# EAGLE schematic eit_passive_filter (EAGLE 9.6.2)

## Sheet 1 of 3
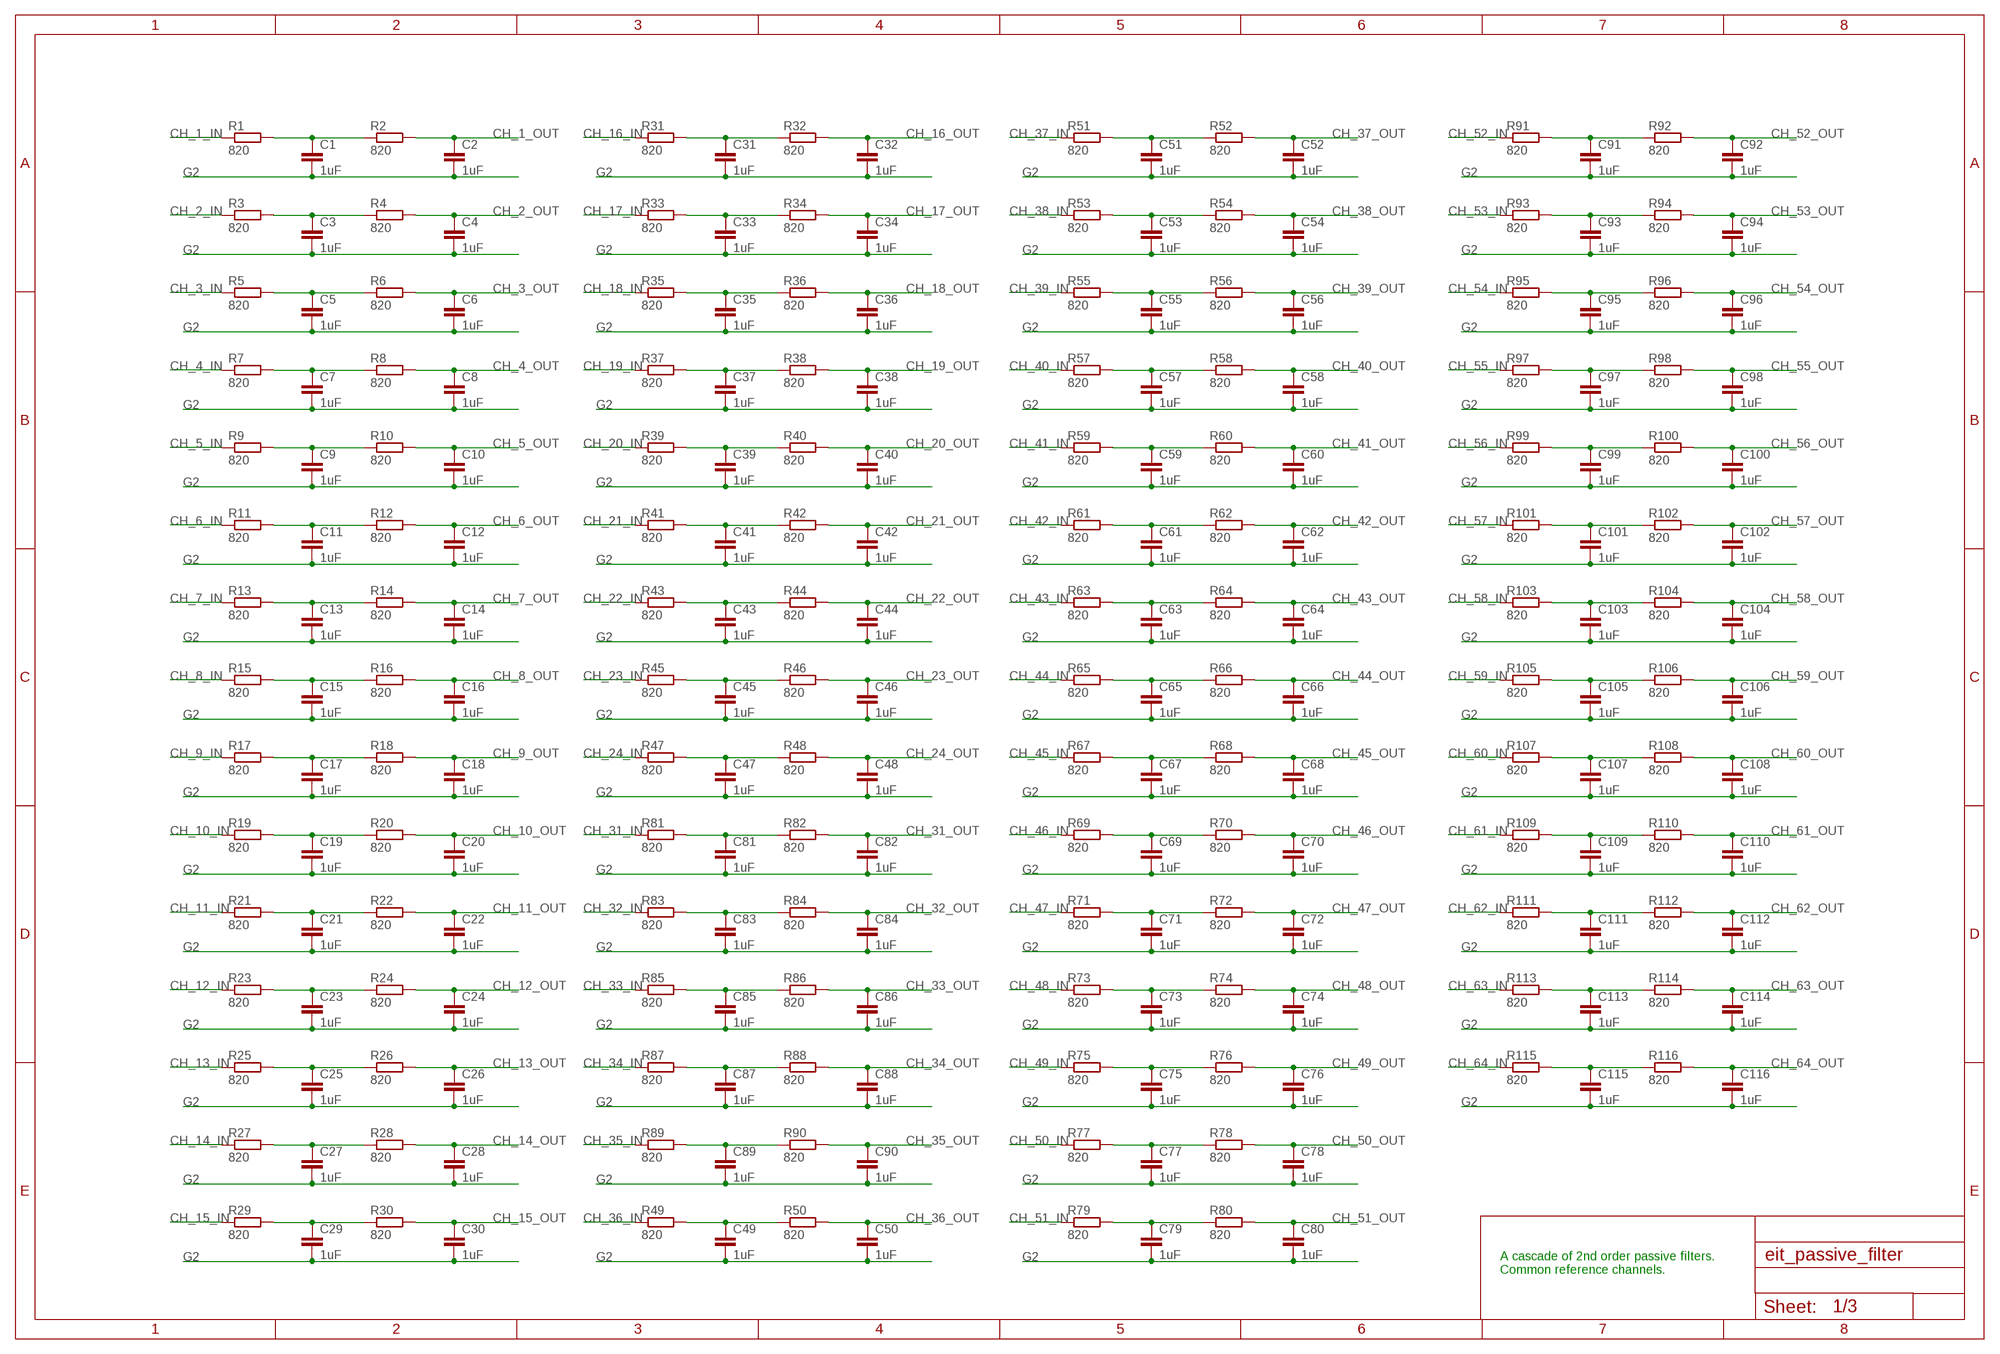
[diagram p0: schematic, sheet 1]

### Parts
C1  1uF  C-EUC0402  [C0402]
C2  1uF  C-EUC0402  [C0402]
C3  1uF  C-EUC0402  [C0402]
C4  1uF  C-EUC0402  [C0402]
C5  1uF  C-EUC0402  [C0402]
C6  1uF  C-EUC0402  [C0402]
C7  1uF  C-EUC0402  [C0402]
C8  1uF  C-EUC0402  [C0402]
C9  1uF  C-EUC0402  [C0402]
C10  1uF  C-EUC0402  [C0402]
C11  1uF  C-EUC0402  [C0402]
C12  1uF  C-EUC0402  [C0402]
C13  1uF  C-EUC0402  [C0402]
C14  1uF  C-EUC0402  [C0402]
C15  1uF  C-EUC0402  [C0402]
C16  1uF  C-EUC0402  [C0402]
C17  1uF  C-EUC0402  [C0402]
C18  1uF  C-EUC0402  [C0402]
C19  1uF  C-EUC0402  [C0402]
C20  1uF  C-EUC0402  [C0402]
C21  1uF  C-EUC0402  [C0402]
C22  1uF  C-EUC0402  [C0402]
C23  1uF  C-EUC0402  [C0402]
C24  1uF  C-EUC0402  [C0402]
C25  1uF  C-EUC0402  [C0402]
C26  1uF  C-EUC0402  [C0402]
C27  1uF  C-EUC0402  [C0402]
C28  1uF  C-EUC0402  [C0402]
C29  1uF  C-EUC0402  [C0402]
C30  1uF  C-EUC0402  [C0402]
C31  1uF  C-EUC0402  [C0402]
C32  1uF  C-EUC0402  [C0402]
C33  1uF  C-EUC0402  [C0402]
C34  1uF  C-EUC0402  [C0402]
C35  1uF  C-EUC0402  [C0402]
C36  1uF  C-EUC0402  [C0402]
C37  1uF  C-EUC0402  [C0402]
C38  1uF  C-EUC0402  [C0402]
C39  1uF  C-EUC0402  [C0402]
C40  1uF  C-EUC0402  [C0402]
C41  1uF  C-EUC0402  [C0402]
C42  1uF  C-EUC0402  [C0402]
C43  1uF  C-EUC0402  [C0402]
C44  1uF  C-EUC0402  [C0402]
C45  1uF  C-EUC0402  [C0402]
C46  1uF  C-EUC0402  [C0402]
C47  1uF  C-EUC0402  [C0402]
C48  1uF  C-EUC0402  [C0402]
C49  1uF  C-EUC0402  [C0402]
C50  1uF  C-EUC0402  [C0402]
C51  1uF  C-EUC0402  [C0402]
C52  1uF  C-EUC0402  [C0402]
C53  1uF  C-EUC0402  [C0402]
C54  1uF  C-EUC0402  [C0402]
C55  1uF  C-EUC0402  [C0402]
C56  1uF  C-EUC0402  [C0402]
C57  1uF  C-EUC0402  [C0402]
C58  1uF  C-EUC0402  [C0402]
C59  1uF  C-EUC0402  [C0402]
C60  1uF  C-EUC0402  [C0402]
C61  1uF  C-EUC0402  [C0402]
C62  1uF  C-EUC0402  [C0402]
C63  1uF  C-EUC0402  [C0402]
C64  1uF  C-EUC0402  [C0402]
C65  1uF  C-EUC0402  [C0402]
C66  1uF  C-EUC0402  [C0402]
C67  1uF  C-EUC0402  [C0402]
C68  1uF  C-EUC0402  [C0402]
C69  1uF  C-EUC0402  [C0402]
C70  1uF  C-EUC0402  [C0402]
C71  1uF  C-EUC0402  [C0402]
C72  1uF  C-EUC0402  [C0402]
C73  1uF  C-EUC0402  [C0402]
C74  1uF  C-EUC0402  [C0402]
C75  1uF  C-EUC0402  [C0402]
C76  1uF  C-EUC0402  [C0402]
C77  1uF  C-EUC0402  [C0402]
C78  1uF  C-EUC0402  [C0402]
C79  1uF  C-EUC0402  [C0402]
C80  1uF  C-EUC0402  [C0402]
C81  1uF  C-EUC0402  [C0402]
C82  1uF  C-EUC0402  [C0402]
C83  1uF  C-EUC0402  [C0402]
C84  1uF  C-EUC0402  [C0402]
C85  1uF  C-EUC0402  [C0402]
C86  1uF  C-EUC0402  [C0402]
C87  1uF  C-EUC0402  [C0402]
C88  1uF  C-EUC0402  [C0402]
C89  1uF  C-EUC0402  [C0402]
C90  1uF  C-EUC0402  [C0402]
C91  1uF  C-EUC0402  [C0402]
C92  1uF  C-EUC0402  [C0402]
C93  1uF  C-EUC0402  [C0402]
C94  1uF  C-EUC0402  [C0402]
C95  1uF  C-EUC0402  [C0402]
C96  1uF  C-EUC0402  [C0402]
C97  1uF  C-EUC0402  [C0402]
C98  1uF  C-EUC0402  [C0402]
C99  1uF  C-EUC0402  [C0402]
C100  1uF  C-EUC0402  [C0402]
C101  1uF  C-EUC0402  [C0402]
C102  1uF  C-EUC0402  [C0402]
C103  1uF  C-EUC0402  [C0402]
C104  1uF  C-EUC0402  [C0402]
C105  1uF  C-EUC0402  [C0402]
C106  1uF  C-EUC0402  [C0402]
C107  1uF  C-EUC0402  [C0402]
C108  1uF  C-EUC0402  [C0402]
C109  1uF  C-EUC0402  [C0402]
C110  1uF  C-EUC0402  [C0402]
C111  1uF  C-EUC0402  [C0402]
C112  1uF  C-EUC0402  [C0402]
C113  1uF  C-EUC0402  [C0402]
C114  1uF  C-EUC0402  [C0402]
C115  1uF  C-EUC0402  [C0402]
C116  1uF  C-EUC0402  [C0402]
R1  820  R-EU_R0402  [R0402]
R2  820  R-EU_R0402  [R0402]
R3  820  R-EU_R0402  [R0402]
R4  820  R-EU_R0402  [R0402]
R5  820  R-EU_R0402  [R0402]
R6  820  R-EU_R0402  [R0402]
R7  820  R-EU_R0402  [R0402]
R8  820  R-EU_R0402  [R0402]
R9  820  R-EU_R0402  [R0402]
R10  820  R-EU_R0402  [R0402]
R11  820  R-EU_R0402  [R0402]
R12  820  R-EU_R0402  [R0402]
R13  820  R-EU_R0402  [R0402]
R14  820  R-EU_R0402  [R0402]
R15  820  R-EU_R0402  [R0402]
R16  820  R-EU_R0402  [R0402]
R17  820  R-EU_R0402  [R0402]
R18  820  R-EU_R0402  [R0402]
R19  820  R-EU_R0402  [R0402]
R20  820  R-EU_R0402  [R0402]
R21  820  R-EU_R0402  [R0402]
R22  820  R-EU_R0402  [R0402]
R23  820  R-EU_R0402  [R0402]
R24  820  R-EU_R0402  [R0402]
R25  820  R-EU_R0402  [R0402]
R26  820  R-EU_R0402  [R0402]
R27  820  R-EU_R0402  [R0402]
R28  820  R-EU_R0402  [R0402]
R29  820  R-EU_R0402  [R0402]
R30  820  R-EU_R0402  [R0402]
R31  820  R-EU_R0402  [R0402]
R32  820  R-EU_R0402  [R0402]
R33  820  R-EU_R0402  [R0402]
R34  820  R-EU_R0402  [R0402]
R35  820  R-EU_R0402  [R0402]
R36  820  R-EU_R0402  [R0402]
R37  820  R-EU_R0402  [R0402]
R38  820  R-EU_R0402  [R0402]
R39  820  R-EU_R0402  [R0402]
R40  820  R-EU_R0402  [R0402]
R41  820  R-EU_R0402  [R0402]
R42  820  R-EU_R0402  [R0402]
R43  820  R-EU_R0402  [R0402]
R44  820  R-EU_R0402  [R0402]
R45  820  R-EU_R0402  [R0402]
R46  820  R-EU_R0402  [R0402]
R47  820  R-EU_R0402  [R0402]
R48  820  R-EU_R0402  [R0402]
R49  820  R-EU_R0402  [R0402]
R50  820  R-EU_R0402  [R0402]
R51  820  R-EU_R0402  [R0402]
R52  820  R-EU_R0402  [R0402]
R53  820  R-EU_R0402  [R0402]
R54  820  R-EU_R0402  [R0402]
R55  820  R-EU_R0402  [R0402]
R56  820  R-EU_R0402  [R0402]
R57  820  R-EU_R0402  [R0402]
R58  820  R-EU_R0402  [R0402]
R59  820  R-EU_R0402  [R0402]
R60  820  R-EU_R0402  [R0402]
R61  820  R-EU_R0402  [R0402]
R62  820  R-EU_R0402  [R0402]
R63  820  R-EU_R0402  [R0402]
R64  820  R-EU_R0402  [R0402]
R65  820  R-EU_R0402  [R0402]
R66  820  R-EU_R0402  [R0402]
R67  820  R-EU_R0402  [R0402]
R68  820  R-EU_R0402  [R0402]
R69  820  R-EU_R0402  [R0402]
R70  820  R-EU_R0402  [R0402]
R71  820  R-EU_R0402  [R0402]
R72  820  R-EU_R0402  [R0402]
R73  820  R-EU_R0402  [R0402]
R74  820  R-EU_R0402  [R0402]
R75  820  R-EU_R0402  [R0402]
R76  820  R-EU_R0402  [R0402]
R77  820  R-EU_R0402  [R0402]
R78  820  R-EU_R0402  [R0402]
R79  820  R-EU_R0402  [R0402]
R80  820  R-EU_R0402  [R0402]
R81  820  R-EU_R0402  [R0402]
R82  820  R-EU_R0402  [R0402]
R83  820  R-EU_R0402  [R0402]
R84  820  R-EU_R0402  [R0402]
R85  820  R-EU_R0402  [R0402]
R86  820  R-EU_R0402  [R0402]
R87  820  R-EU_R0402  [R0402]
R88  820  R-EU_R0402  [R0402]
R89  820  R-EU_R0402  [R0402]
R90  820  R-EU_R0402  [R0402]
R91  820  R-EU_R0402  [R0402]
R92  820  R-EU_R0402  [R0402]
R93  820  R-EU_R0402  [R0402]
R94  820  R-EU_R0402  [R0402]
R95  820  R-EU_R0402  [R0402]
R96  820  R-EU_R0402  [R0402]
R97  820  R-EU_R0402  [R0402]
R98  820  R-EU_R0402  [R0402]
R99  820  R-EU_R0402  [R0402]
R100  820  R-EU_R0402  [R0402]
R101  820  R-EU_R0402  [R0402]
R102  820  R-EU_R0402  [R0402]
R103  820  R-EU_R0402  [R0402]
R104  820  R-EU_R0402  [R0402]
R105  820  R-EU_R0402  [R0402]
R106  820  R-EU_R0402  [R0402]
R107  820  R-EU_R0402  [R0402]
R108  820  R-EU_R0402  [R0402]
R109  820  R-EU_R0402  [R0402]
R110  820  R-EU_R0402  [R0402]
R111  820  R-EU_R0402  [R0402]
R112  820  R-EU_R0402  [R0402]
R113  820  R-EU_R0402  [R0402]
R114  820  R-EU_R0402  [R0402]
R115  820  R-EU_R0402  [R0402]
R116  820  R-EU_R0402  [R0402]

### Nets
CH_1_IN: R1.1 ; also sheet 3
CH_1_OUT: C2.1 R2.2 ; also sheet 3
CH_2_IN: R3.1 ; also sheet 3
CH_2_OUT: C4.1 R4.2 ; also sheet 3
CH_3_IN: R5.1 ; also sheet 3
CH_3_OUT: C6.1 R6.2 ; also sheet 3
CH_4_IN: R7.1 ; also sheet 3
CH_4_OUT: C8.1 R8.2 ; also sheet 3
CH_5_IN: R9.1 ; also sheet 3
CH_5_OUT: C10.1 R10.2 ; also sheet 3
CH_6_IN: R11.1 ; also sheet 3
CH_6_OUT: C12.1 R12.2 ; also sheet 3
CH_7_IN: R13.1 ; also sheet 3
CH_7_OUT: C14.1 R14.2 ; also sheet 3
CH_8_IN: R15.1 ; also sheet 3
CH_8_OUT: C16.1 R16.2 ; also sheet 3
CH_9_IN: R17.1 ; also sheet 3
CH_9_OUT: C18.1 R18.2 ; also sheet 3
CH_10_IN: R19.1 ; also sheet 3
CH_10_OUT: C20.1 R20.2 ; also sheet 3
CH_11_IN: R21.1 ; also sheet 3
CH_11_OUT: C22.1 R22.2 ; also sheet 3
CH_12_IN: R23.1 ; also sheet 3
CH_12_OUT: C24.1 R24.2 ; also sheet 3
CH_13_IN: R25.1 ; also sheet 3
CH_13_OUT: C26.1 R26.2 ; also sheet 3
CH_14_IN: R27.1 ; also sheet 3
CH_14_OUT: C28.1 R28.2 ; also sheet 3
CH_15_IN: R29.1 ; also sheet 3
CH_15_OUT: C30.1 R30.2 ; also sheet 3
CH_16_IN: R31.1 ; also sheet 3
CH_16_OUT: C32.1 R32.2 ; also sheet 3
CH_17_IN: R33.1 ; also sheet 3
CH_17_OUT: C34.1 R34.2 ; also sheet 3
CH_18_IN: R35.1 ; also sheet 3
CH_18_OUT: C36.1 R36.2 ; also sheet 3
CH_19_IN: R37.1 ; also sheet 3
CH_19_OUT: C38.1 R38.2 ; also sheet 3
CH_20_IN: R39.1 ; also sheet 3
CH_20_OUT: C40.1 R40.2 ; also sheet 3
CH_21_IN: R41.1 ; also sheet 3
CH_21_OUT: C42.1 R42.2 ; also sheet 3
CH_22_IN: R43.1 ; also sheet 3
CH_22_OUT: C44.1 R44.2 ; also sheet 3
CH_23_IN: R45.1 ; also sheet 3
CH_23_OUT: C46.1 R46.2 ; also sheet 3
CH_24_IN: R47.1 ; also sheet 3
CH_24_OUT: C48.1 R48.2 ; also sheet 3
CH_31_IN: R81.1 ; also sheet 3
CH_31_OUT: C82.1 R82.2 ; also sheet 3
CH_32_IN: R83.1 ; also sheet 3
CH_32_OUT: C84.1 R84.2 ; also sheet 3
CH_33_IN: R85.1 ; also sheet 3
CH_33_OUT: C86.1 R86.2 ; also sheet 3
CH_34_IN: R87.1 ; also sheet 3
CH_34_OUT: C88.1 R88.2 ; also sheet 3
CH_35_IN: R89.1 ; also sheet 3
CH_35_OUT: C90.1 R90.2 ; also sheet 3
CH_36_IN: R49.1 ; also sheet 3
CH_36_OUT: C50.1 R50.2 ; also sheet 3
CH_37_IN: R51.1 ; also sheet 3
CH_37_OUT: C52.1 R52.2 ; also sheet 3
CH_38_IN: R53.1 ; also sheet 3
CH_38_OUT: C54.1 R54.2 ; also sheet 3
CH_39_IN: R55.1 ; also sheet 3
CH_39_OUT: C56.1 R56.2 ; also sheet 3
CH_40_IN: R57.1 ; also sheet 3
CH_40_OUT: C58.1 R58.2 ; also sheet 3
CH_41_IN: R59.1 ; also sheet 3
CH_41_OUT: C60.1 R60.2 ; also sheet 3
CH_42_IN: R61.1 ; also sheet 3
CH_42_OUT: C62.1 R62.2 ; also sheet 3
CH_43_IN: R63.1 ; also sheet 3
CH_43_OUT: C64.1 R64.2 ; also sheet 3
CH_44_IN: R65.1 ; also sheet 3
CH_44_OUT: C66.1 R66.2 ; also sheet 3
CH_45_IN: R67.1 ; also sheet 3
CH_45_OUT: C68.1 R68.2 ; also sheet 3
CH_46_IN: R69.1 ; also sheet 3
CH_46_OUT: C70.1 R70.2 ; also sheet 3
CH_47_IN: R71.1 ; also sheet 3
CH_47_OUT: C72.1 R72.2 ; also sheet 3
CH_48_IN: R73.1 ; also sheet 3
CH_48_OUT: C74.1 R74.2 ; also sheet 3
CH_49_IN: R75.1 ; also sheet 3
CH_49_OUT: C76.1 R76.2 ; also sheet 3
CH_50_IN: R77.1 ; also sheet 3
CH_50_OUT: C78.1 R78.2 ; also sheet 3
CH_51_IN: R79.1 ; also sheet 3
CH_51_OUT: C80.1 R80.2 ; also sheet 3
CH_52_IN: R91.1 ; also sheet 3
CH_52_OUT: C92.1 R92.2 ; also sheet 3
CH_53_IN: R93.1 ; also sheet 3
CH_53_OUT: C94.1 R94.2 ; also sheet 3
CH_54_IN: R95.1 ; also sheet 3
CH_54_OUT: C96.1 R96.2 ; also sheet 3
CH_55_IN: R97.1 ; also sheet 3
CH_55_OUT: C98.1 R98.2 ; also sheet 3
CH_56_IN: R99.1 ; also sheet 3
CH_56_OUT: C100.1 R100.2 ; also sheet 3
CH_57_IN: R101.1 ; also sheet 3
CH_57_OUT: C102.1 R102.2 ; also sheet 3
CH_58_IN: R103.1 ; also sheet 3
CH_58_OUT: C104.1 R104.2 ; also sheet 3
CH_59_IN: R105.1 ; also sheet 3
CH_59_OUT: C106.1 R106.2 ; also sheet 3
CH_60_IN: R107.1 ; also sheet 3
CH_60_OUT: C108.1 R108.2 ; also sheet 3
CH_61_IN: R109.1 ; also sheet 3
CH_61_OUT: C110.1 R110.2 ; also sheet 3
CH_62_IN: R111.1 ; also sheet 3
CH_62_OUT: C112.1 R112.2 ; also sheet 3
CH_63_IN: R113.1 ; also sheet 3
CH_63_OUT: C114.1 R114.2 ; also sheet 3
CH_64_IN: R115.1 ; also sheet 3
CH_64_OUT: C116.1 R116.2 ; also sheet 3
G2: C1.2 C2.2 C3.2 C4.2 C5.2 C6.2 C7.2 C8.2 C9.2 C10.2 C11.2 C12.2 C13.2 C14.2 C15.2 C16.2 C17.2 C18.2 C19.2 C20.2 C21.2 C22.2 C23.2 C24.2 C25.2 C26.2 C27.2 C28.2 C29.2 C30.2 C31.2 C32.2 C33.2 C34.2 C35.2 C36.2 C37.2 C38.2 C39.2 C40.2 C41.2 C42.2 C43.2 C44.2 C45.2 C46.2 C47.2 C48.2 C49.2 C50.2 C51.2 C52.2 C53.2 C54.2 C55.2 C56.2 C57.2 C58.2 C59.2 C60.2 C61.2 C62.2 C63.2 C64.2 C65.2 C66.2 C67.2 C68.2 C69.2 C70.2 C71.2 C72.2 C73.2 C74.2 C75.2 C76.2 C77.2 C78.2 C79.2 C80.2 C81.2 C82.2 C83.2 C84.2 C85.2 C86.2 C87.2 C88.2 C89.2 C90.2 C91.2 C92.2 C93.2 C94.2 C95.2 C96.2 C97.2 C98.2 C99.2 C100.2 C101.2 C102.2 C103.2 C104.2 C105.2 C106.2 C107.2 C108.2 C109.2 C110.2 C111.2 C112.2 C113.2 C114.2 C115.2 C116.2 ; also sheet 3
N$1: C1.1 R1.2 R2.1
N$82: C3.1 R3.2 R4.1
N$83: C5.1 R5.2 R6.1
N$84: C7.1 R7.2 R8.1
N$85: C9.1 R9.2 R10.1
N$86: C11.1 R11.2 R12.1
N$87: C13.1 R13.2 R14.1
N$88: C15.1 R15.2 R16.1
N$89: C17.1 R17.2 R18.1
N$90: C19.1 R19.2 R20.1
N$91: C21.1 R21.2 R22.1
N$92: C23.1 R23.2 R24.1
N$93: C25.1 R25.2 R26.1
N$94: C27.1 R27.2 R28.1
N$95: C29.1 R29.2 R30.1
N$96: C31.1 R31.2 R32.1
N$97: C33.1 R33.2 R34.1
N$98: C35.1 R35.2 R36.1
N$99: C37.1 R37.2 R38.1
N$100: C39.1 R39.2 R40.1
N$101: C41.1 R41.2 R42.1
N$102: C43.1 R43.2 R44.1
N$103: C45.1 R45.2 R46.1
N$104: C47.1 R47.2 R48.1
N$105: C49.1 R49.2 R50.1
N$106: C51.1 R51.2 R52.1
N$107: C53.1 R53.2 R54.1
N$108: C55.1 R55.2 R56.1
N$109: C57.1 R57.2 R58.1
N$110: C59.1 R59.2 R60.1
N$111: C61.1 R61.2 R62.1
N$112: C63.1 R63.2 R64.1
N$113: C65.1 R65.2 R66.1
N$114: C67.1 R67.2 R68.1
N$115: C69.1 R69.2 R70.1
N$116: C71.1 R71.2 R72.1
N$117: C73.1 R73.2 R74.1
N$118: C75.1 R75.2 R76.1
N$119: C77.1 R77.2 R78.1
N$120: C79.1 R79.2 R80.1
N$121: C81.1 R81.2 R82.1
N$122: C83.1 R83.2 R84.1
N$123: C85.1 R85.2 R86.1
N$124: C87.1 R87.2 R88.1
N$125: C89.1 R89.2 R90.1
N$126: C91.1 R91.2 R92.1
N$127: C93.1 R93.2 R94.1
N$128: C95.1 R95.2 R96.1
N$129: C97.1 R97.2 R98.1
N$130: C99.1 R99.2 R100.1
N$131: C101.1 R101.2 R102.1
N$132: C103.1 R103.2 R104.1
N$133: C105.1 R105.2 R106.1
N$134: C107.1 R107.2 R108.1
N$135: C109.1 R109.2 R110.1
N$136: C111.1 R111.2 R112.1
N$137: C113.1 R113.2 R114.1
N$138: C115.1 R115.2 R116.1

### Notes on the sheet
- A cascade of 2nd order passive filters. 
  Common reference channels.

## Sheet 2 of 3
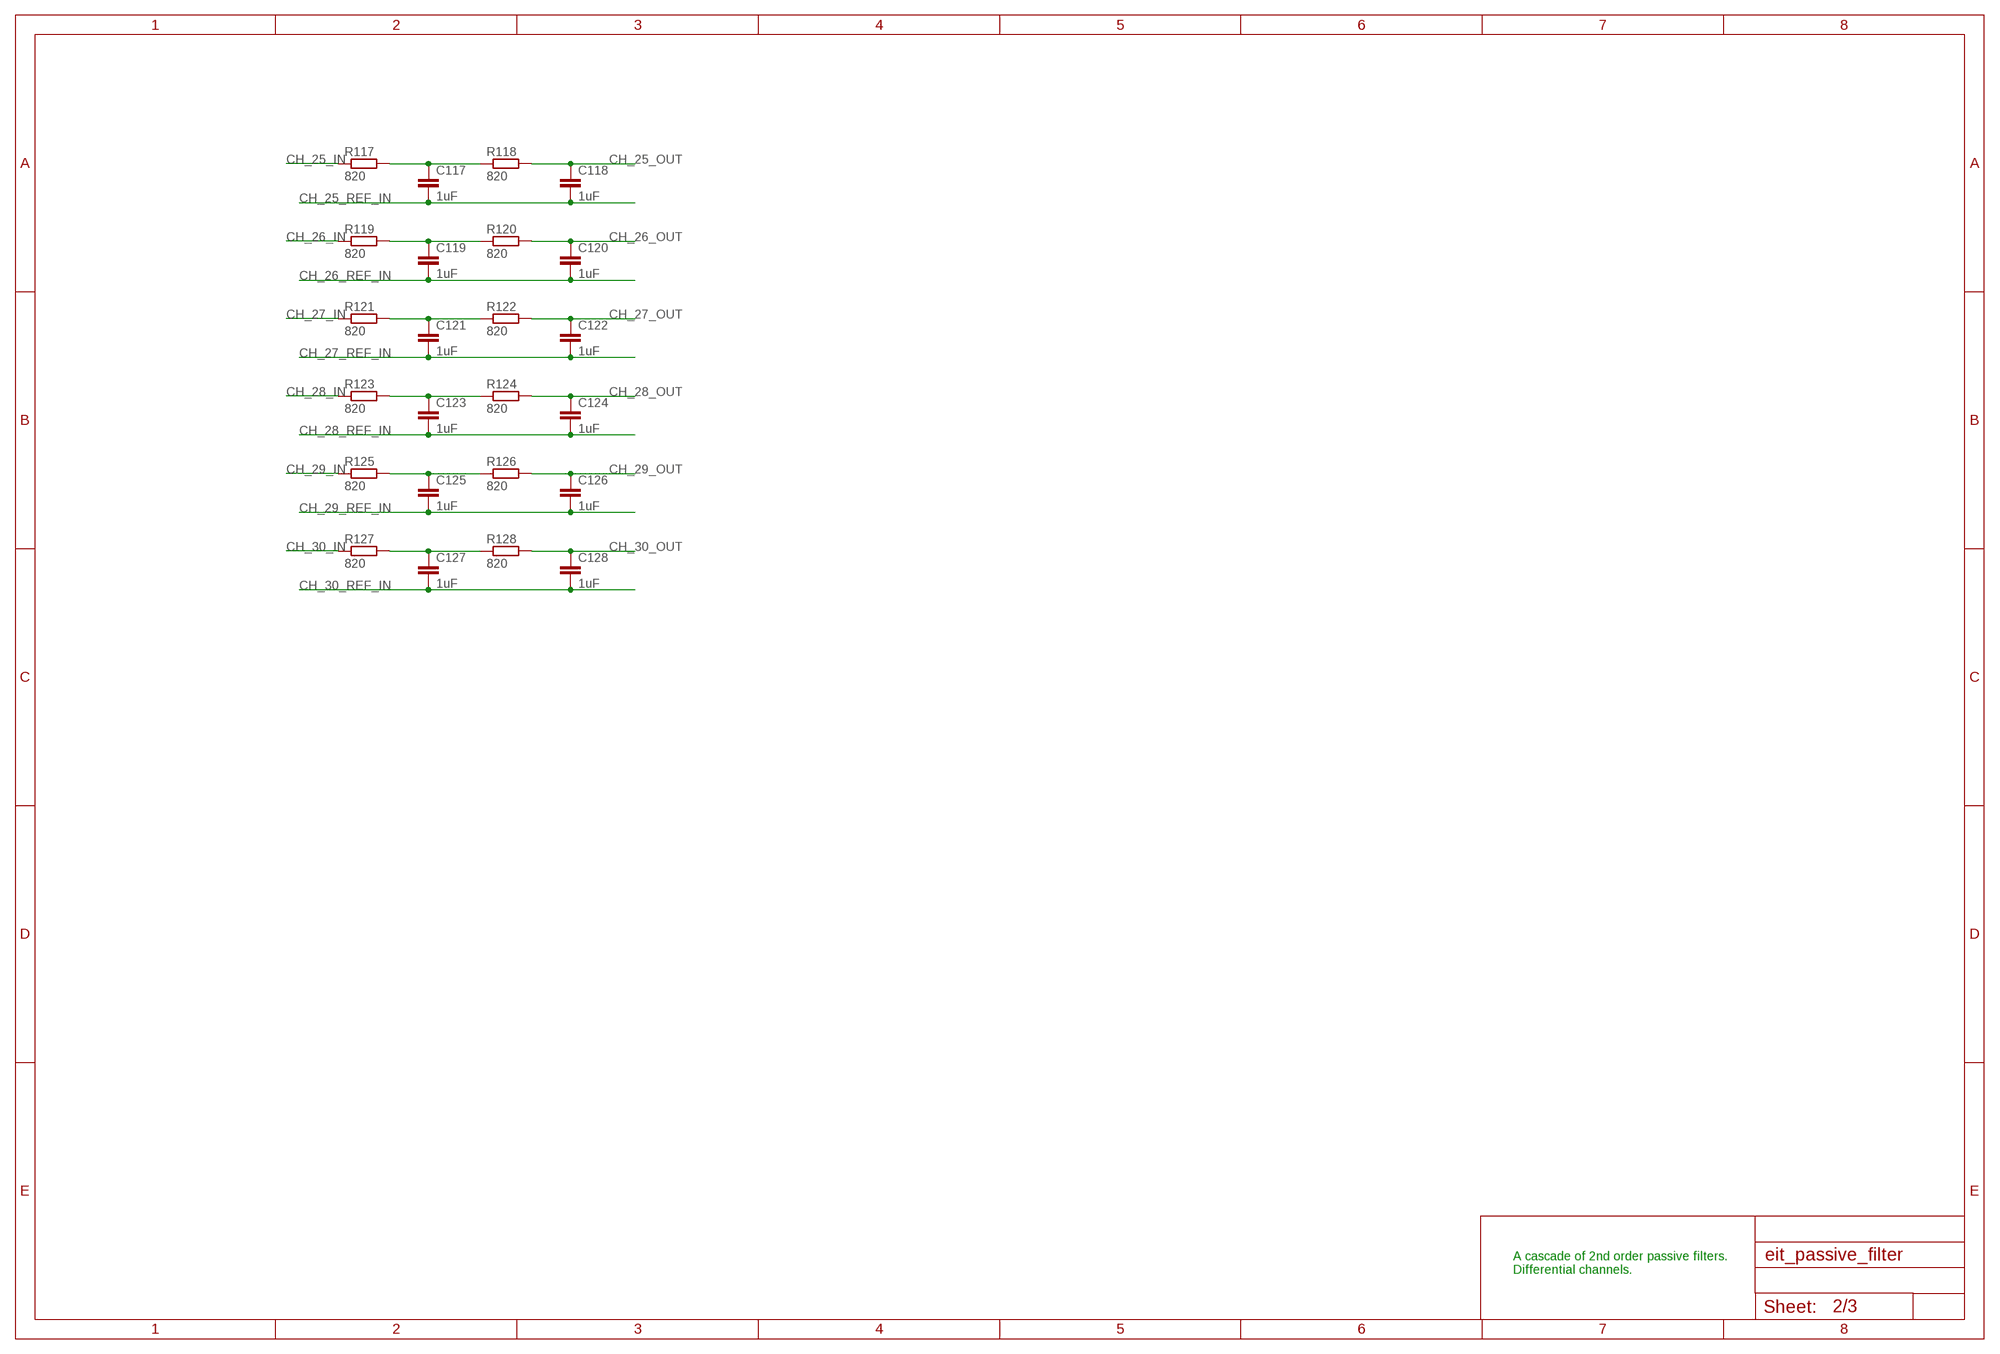
[diagram p1: schematic, sheet 2]

### Parts
C117  1uF  C-EUC0402  [C0402]
C118  1uF  C-EUC0402  [C0402]
C119  1uF  C-EUC0402  [C0402]
C120  1uF  C-EUC0402  [C0402]
C121  1uF  C-EUC0402  [C0402]
C122  1uF  C-EUC0402  [C0402]
C123  1uF  C-EUC0402  [C0402]
C124  1uF  C-EUC0402  [C0402]
C125  1uF  C-EUC0402  [C0402]
C126  1uF  C-EUC0402  [C0402]
C127  1uF  C-EUC0402  [C0402]
C128  1uF  C-EUC0402  [C0402]
R117  820  R-EU_R0402  [R0402]
R118  820  R-EU_R0402  [R0402]
R119  820  R-EU_R0402  [R0402]
R120  820  R-EU_R0402  [R0402]
R121  820  R-EU_R0402  [R0402]
R122  820  R-EU_R0402  [R0402]
R123  820  R-EU_R0402  [R0402]
R124  820  R-EU_R0402  [R0402]
R125  820  R-EU_R0402  [R0402]
R126  820  R-EU_R0402  [R0402]
R127  820  R-EU_R0402  [R0402]
R128  820  R-EU_R0402  [R0402]

### Nets
CH_25_IN: R117.1 ; also sheet 3
CH_25_OUT: C118.1 R118.2 ; also sheet 3
CH_25_REF_IN: C117.2 C118.2 ; also sheet 3
CH_26_IN: R119.1 ; also sheet 3
CH_26_OUT: C120.1 R120.2 ; also sheet 3
CH_26_REF_IN: C119.2 C120.2 ; also sheet 3
CH_27_IN: R121.1 ; also sheet 3
CH_27_OUT: C122.1 R122.2 ; also sheet 3
CH_27_REF_IN: C121.2 C122.2 ; also sheet 3
CH_28_IN: R123.1 ; also sheet 3
CH_28_OUT: C124.1 R124.2 ; also sheet 3
CH_28_REF_IN: C123.2 C124.2 ; also sheet 3
CH_29_IN: R125.1 ; also sheet 3
CH_29_OUT: C126.1 R126.2 ; also sheet 3
CH_29_REF_IN: C125.2 C126.2 ; also sheet 3
CH_30_IN: R127.1 ; also sheet 3
CH_30_OUT: C128.1 R128.2 ; also sheet 3
CH_30_REF_IN: C127.2 C128.2 ; also sheet 3
N$139: C117.1 R117.2 R118.1
N$140: C119.1 R119.2 R120.1
N$141: C121.1 R121.2 R122.1
N$142: C123.1 R123.2 R124.1
N$143: C125.1 R125.2 R126.1
N$144: C127.1 R127.2 R128.1

### Notes on the sheet
- A cascade of 2nd order passive filters. 
  Differential channels.

## Sheet 3 of 3
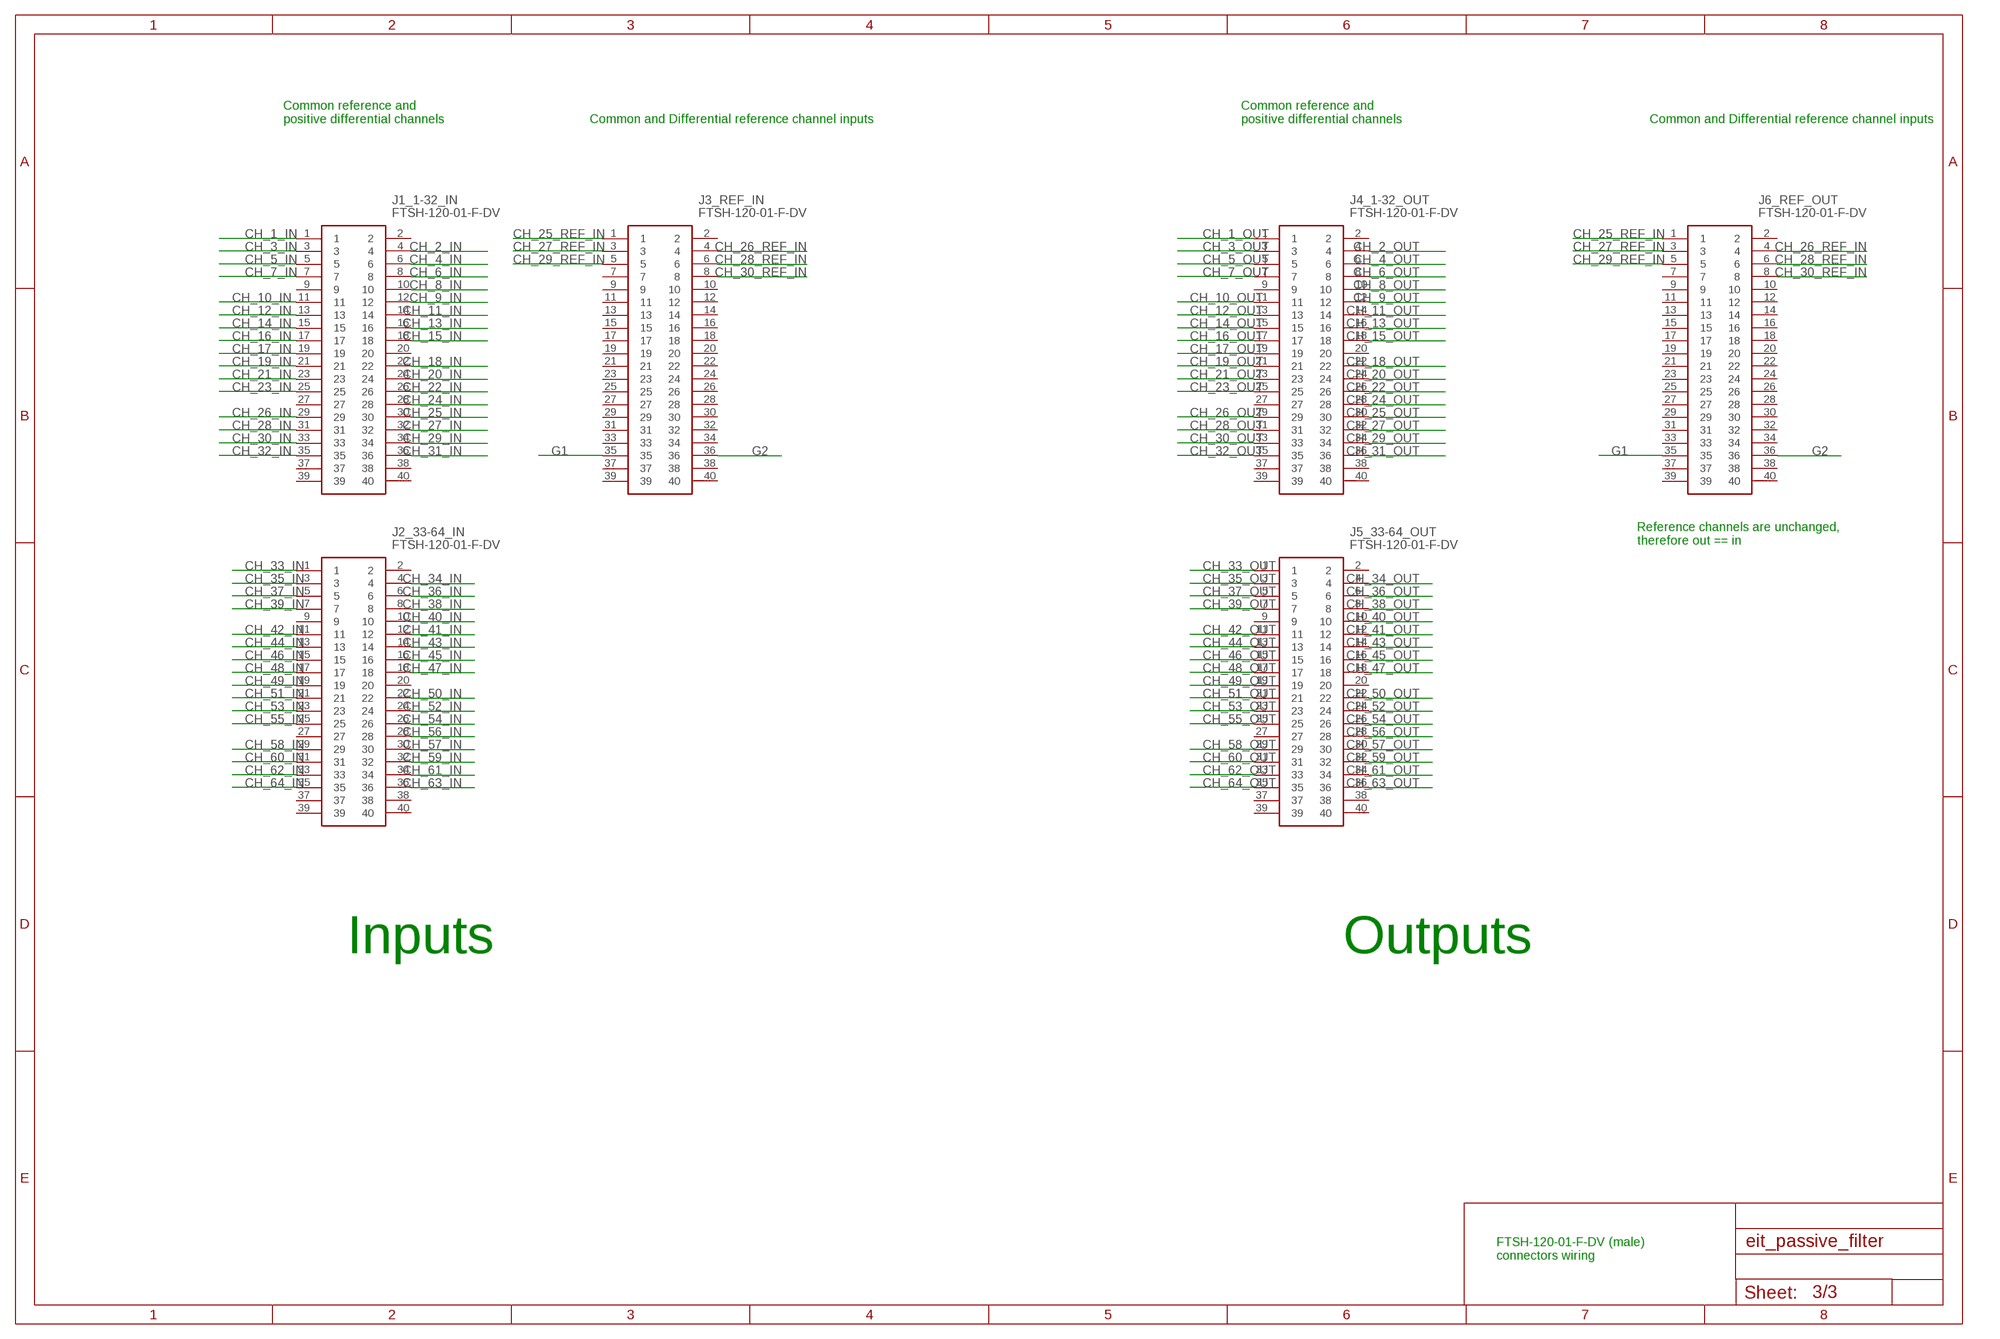
[diagram p2: schematic, sheet 3]

### Parts
J1_1-32_IN  FTSH-120-01-F-DV  [FTSH-120-XX-YYY-DV]
J2_33-64_IN  FTSH-120-01-F-DV  [FTSH-120-XX-YYY-DV]
J3_REF_IN  FTSH-120-01-F-DV  [FTSH-120-XX-YYY-DV]
J4_1-32_OUT  FTSH-120-01-F-DV  [FTSH-120-XX-YYY-DV]
J5_33-64_OUT  FTSH-120-01-F-DV  [FTSH-120-XX-YYY-DV]
J6_REF_OUT  FTSH-120-01-F-DV  [FTSH-120-XX-YYY-DV]

### Nets
CH_1_IN: J1_1-32_IN.1 ; also sheet 1
CH_1_OUT: J4_1-32_OUT.1 ; also sheet 1
CH_2_IN: J1_1-32_IN.4 ; also sheet 1
CH_2_OUT: J4_1-32_OUT.4 ; also sheet 1
CH_3_IN: J1_1-32_IN.3 ; also sheet 1
CH_3_OUT: J4_1-32_OUT.3 ; also sheet 1
CH_4_IN: J1_1-32_IN.6 ; also sheet 1
CH_4_OUT: J4_1-32_OUT.6 ; also sheet 1
CH_5_IN: J1_1-32_IN.5 ; also sheet 1
CH_5_OUT: J4_1-32_OUT.5 ; also sheet 1
CH_6_IN: J1_1-32_IN.8 ; also sheet 1
CH_6_OUT: J4_1-32_OUT.8 ; also sheet 1
CH_7_IN: J1_1-32_IN.7 ; also sheet 1
CH_7_OUT: J4_1-32_OUT.7 ; also sheet 1
CH_8_IN: J1_1-32_IN.10 ; also sheet 1
CH_8_OUT: J4_1-32_OUT.10 ; also sheet 1
CH_9_IN: J1_1-32_IN.12 ; also sheet 1
CH_9_OUT: J4_1-32_OUT.12 ; also sheet 1
CH_10_IN: J1_1-32_IN.11 ; also sheet 1
CH_10_OUT: J4_1-32_OUT.11 ; also sheet 1
CH_11_IN: J1_1-32_IN.14 ; also sheet 1
CH_11_OUT: J4_1-32_OUT.14 ; also sheet 1
CH_12_IN: J1_1-32_IN.13 ; also sheet 1
CH_12_OUT: J4_1-32_OUT.13 ; also sheet 1
CH_13_IN: J1_1-32_IN.16 ; also sheet 1
CH_13_OUT: J4_1-32_OUT.16 ; also sheet 1
CH_14_IN: J1_1-32_IN.15 ; also sheet 1
CH_14_OUT: J4_1-32_OUT.15 ; also sheet 1
CH_15_IN: J1_1-32_IN.18 ; also sheet 1
CH_15_OUT: J4_1-32_OUT.18 ; also sheet 1
CH_16_IN: J1_1-32_IN.17 ; also sheet 1
CH_16_OUT: J4_1-32_OUT.17 ; also sheet 1
CH_17_IN: J1_1-32_IN.19 ; also sheet 1
CH_17_OUT: J4_1-32_OUT.19 ; also sheet 1
CH_18_IN: J1_1-32_IN.22 ; also sheet 1
CH_18_OUT: J4_1-32_OUT.22 ; also sheet 1
CH_19_IN: J1_1-32_IN.21 ; also sheet 1
CH_19_OUT: J4_1-32_OUT.21 ; also sheet 1
CH_20_IN: J1_1-32_IN.24 ; also sheet 1
CH_20_OUT: J4_1-32_OUT.24 ; also sheet 1
CH_21_IN: J1_1-32_IN.23 ; also sheet 1
CH_21_OUT: J4_1-32_OUT.23 ; also sheet 1
CH_22_IN: J1_1-32_IN.26 ; also sheet 1
CH_22_OUT: J4_1-32_OUT.26 ; also sheet 1
CH_23_IN: J1_1-32_IN.25 ; also sheet 1
CH_23_OUT: J4_1-32_OUT.25 ; also sheet 1
CH_24_IN: J1_1-32_IN.28 ; also sheet 1
CH_24_OUT: J4_1-32_OUT.28 ; also sheet 1
CH_25_IN: J1_1-32_IN.30 ; also sheet 2
CH_25_OUT: J4_1-32_OUT.30 ; also sheet 2
CH_25_REF_IN: J3_REF_IN.1 J6_REF_OUT.1 ; also sheet 2
CH_26_IN: J1_1-32_IN.29 ; also sheet 2
CH_26_OUT: J4_1-32_OUT.29 ; also sheet 2
CH_26_REF_IN: J3_REF_IN.4 J6_REF_OUT.4 ; also sheet 2
CH_27_IN: J1_1-32_IN.32 ; also sheet 2
CH_27_OUT: J4_1-32_OUT.32 ; also sheet 2
CH_27_REF_IN: J3_REF_IN.3 J6_REF_OUT.3 ; also sheet 2
CH_28_IN: J1_1-32_IN.31 ; also sheet 2
CH_28_OUT: J4_1-32_OUT.31 ; also sheet 2
CH_28_REF_IN: J3_REF_IN.6 J6_REF_OUT.6 ; also sheet 2
CH_29_IN: J1_1-32_IN.34 ; also sheet 2
CH_29_OUT: J4_1-32_OUT.34 ; also sheet 2
CH_29_REF_IN: J3_REF_IN.5 J6_REF_OUT.5 ; also sheet 2
CH_30_IN: J1_1-32_IN.33 ; also sheet 2
CH_30_OUT: J4_1-32_OUT.33 ; also sheet 2
CH_30_REF_IN: J3_REF_IN.8 J6_REF_OUT.8 ; also sheet 2
CH_31_IN: J1_1-32_IN.36 ; also sheet 1
CH_31_OUT: J4_1-32_OUT.36 ; also sheet 1
CH_32_IN: J1_1-32_IN.35 ; also sheet 1
CH_32_OUT: J4_1-32_OUT.35 ; also sheet 1
CH_33_IN: J2_33-64_IN.1 ; also sheet 1
CH_33_OUT: J5_33-64_OUT.1 ; also sheet 1
CH_34_IN: J2_33-64_IN.4 ; also sheet 1
CH_34_OUT: J5_33-64_OUT.4 ; also sheet 1
CH_35_IN: J2_33-64_IN.3 ; also sheet 1
CH_35_OUT: J5_33-64_OUT.3 ; also sheet 1
CH_36_IN: J2_33-64_IN.6 ; also sheet 1
CH_36_OUT: J5_33-64_OUT.6 ; also sheet 1
CH_37_IN: J2_33-64_IN.5 ; also sheet 1
CH_37_OUT: J5_33-64_OUT.5 ; also sheet 1
CH_38_IN: J2_33-64_IN.8 ; also sheet 1
CH_38_OUT: J5_33-64_OUT.8 ; also sheet 1
CH_39_IN: J2_33-64_IN.7 ; also sheet 1
CH_39_OUT: J5_33-64_OUT.7 ; also sheet 1
CH_40_IN: J2_33-64_IN.10 ; also sheet 1
CH_40_OUT: J5_33-64_OUT.10 ; also sheet 1
CH_41_IN: J2_33-64_IN.12 ; also sheet 1
CH_41_OUT: J5_33-64_OUT.12 ; also sheet 1
CH_42_IN: J2_33-64_IN.11 ; also sheet 1
CH_42_OUT: J5_33-64_OUT.11 ; also sheet 1
CH_43_IN: J2_33-64_IN.14 ; also sheet 1
CH_43_OUT: J5_33-64_OUT.14 ; also sheet 1
CH_44_IN: J2_33-64_IN.13 ; also sheet 1
CH_44_OUT: J5_33-64_OUT.13 ; also sheet 1
CH_45_IN: J2_33-64_IN.16 ; also sheet 1
CH_45_OUT: J5_33-64_OUT.16 ; also sheet 1
CH_46_IN: J2_33-64_IN.15 ; also sheet 1
CH_46_OUT: J5_33-64_OUT.15 ; also sheet 1
CH_47_IN: J2_33-64_IN.18 ; also sheet 1
CH_47_OUT: J5_33-64_OUT.18 ; also sheet 1
CH_48_IN: J2_33-64_IN.17 ; also sheet 1
CH_48_OUT: J5_33-64_OUT.17 ; also sheet 1
CH_49_IN: J2_33-64_IN.19 ; also sheet 1
CH_49_OUT: J5_33-64_OUT.19 ; also sheet 1
CH_50_IN: J2_33-64_IN.22 ; also sheet 1
CH_50_OUT: J5_33-64_OUT.22 ; also sheet 1
CH_51_IN: J2_33-64_IN.21 ; also sheet 1
CH_51_OUT: J5_33-64_OUT.21 ; also sheet 1
CH_52_IN: J2_33-64_IN.24 ; also sheet 1
CH_52_OUT: J5_33-64_OUT.24 ; also sheet 1
CH_53_IN: J2_33-64_IN.23 ; also sheet 1
CH_53_OUT: J5_33-64_OUT.23 ; also sheet 1
CH_54_IN: J2_33-64_IN.26 ; also sheet 1
CH_54_OUT: J5_33-64_OUT.26 ; also sheet 1
CH_55_IN: J2_33-64_IN.25 ; also sheet 1
CH_55_OUT: J5_33-64_OUT.25 ; also sheet 1
CH_56_IN: J2_33-64_IN.28 ; also sheet 1
CH_56_OUT: J5_33-64_OUT.28 ; also sheet 1
CH_57_IN: J2_33-64_IN.30 ; also sheet 1
CH_57_OUT: J5_33-64_OUT.30 ; also sheet 1
CH_58_IN: J2_33-64_IN.29 ; also sheet 1
CH_58_OUT: J5_33-64_OUT.29 ; also sheet 1
CH_59_IN: J2_33-64_IN.32 ; also sheet 1
CH_59_OUT: J5_33-64_OUT.32 ; also sheet 1
CH_60_IN: J2_33-64_IN.31 ; also sheet 1
CH_60_OUT: J5_33-64_OUT.31 ; also sheet 1
CH_61_IN: J2_33-64_IN.34 ; also sheet 1
CH_61_OUT: J5_33-64_OUT.34 ; also sheet 1
CH_62_IN: J2_33-64_IN.33 ; also sheet 1
CH_62_OUT: J5_33-64_OUT.33 ; also sheet 1
CH_63_IN: J2_33-64_IN.36 ; also sheet 1
CH_63_OUT: J5_33-64_OUT.36 ; also sheet 1
CH_64_IN: J2_33-64_IN.35 ; also sheet 1
CH_64_OUT: J5_33-64_OUT.35 ; also sheet 1
G1: J3_REF_IN.35 J6_REF_OUT.35
G2: J3_REF_IN.36 J6_REF_OUT.36 ; also sheet 1
Unconnected: J1_1-32_IN.2 J1_1-32_IN.9 J1_1-32_IN.20 J1_1-32_IN.27 J1_1-32_IN.37 J1_1-32_IN.38 J1_1-32_IN.39 J1_1-32_IN.40 J2_33-64_IN.2 J2_33-64_IN.9 J2_33-64_IN.20 J2_33-64_IN.27 J2_33-64_IN.37 J2_33-64_IN.38 J2_33-64_IN.39 J2_33-64_IN.40 J3_REF_IN.2 J3_REF_IN.7 J3_REF_IN.9 J3_REF_IN.10 J3_REF_IN.11 J3_REF_IN.12 J3_REF_IN.13 J3_REF_IN.14 J3_REF_IN.15 J3_REF_IN.16 J3_REF_IN.17 J3_REF_IN.18 J3_REF_IN.19 J3_REF_IN.20 J3_REF_IN.21 J3_REF_IN.22 J3_REF_IN.23 J3_REF_IN.24 J3_REF_IN.25 J3_REF_IN.26 J3_REF_IN.27 J3_REF_IN.28 J3_REF_IN.29 J3_REF_IN.30 J3_REF_IN.31 J3_REF_IN.32 J3_REF_IN.33 J3_REF_IN.34 J3_REF_IN.37 J3_REF_IN.38 J3_REF_IN.39 J3_REF_IN.40 J4_1-32_OUT.2 J4_1-32_OUT.9 J4_1-32_OUT.20 J4_1-32_OUT.27 J4_1-32_OUT.37 J4_1-32_OUT.38 J4_1-32_OUT.39 J4_1-32_OUT.40 J5_33-64_OUT.2 J5_33-64_OUT.9 J5_33-64_OUT.20 J5_33-64_OUT.27 J5_33-64_OUT.37 J5_33-64_OUT.38 J5_33-64_OUT.39 J5_33-64_OUT.40 J6_REF_OUT.2 J6_REF_OUT.7 J6_REF_OUT.9 J6_REF_OUT.10 J6_REF_OUT.11 J6_REF_OUT.12 J6_REF_OUT.13 J6_REF_OUT.14 J6_REF_OUT.15 J6_REF_OUT.16 J6_REF_OUT.17 J6_REF_OUT.18 J6_REF_OUT.19 J6_REF_OUT.20 J6_REF_OUT.21 J6_REF_OUT.22 J6_REF_OUT.23 J6_REF_OUT.24 J6_REF_OUT.25 J6_REF_OUT.26 J6_REF_OUT.27 J6_REF_OUT.28 J6_REF_OUT.29 J6_REF_OUT.30 J6_REF_OUT.31 J6_REF_OUT.32 J6_REF_OUT.33 J6_REF_OUT.34 J6_REF_OUT.37 J6_REF_OUT.38 J6_REF_OUT.39 J6_REF_OUT.40

### Notes on the sheet
- Common reference and 
  positive differential channels
- Common and Differential reference channel inputs
- Common reference and 
  positive differential channels
- Common and Differential reference channel inputs
- Reference channels are unchanged,
  therefore out == in
- Inputs | Outputs
- FTSH-120-01-F-DV (male)
  connectors wiring

## Library data of the parts
C1-C128 = rcl:C-EU: CAPACITOR, European symbol; SPICEPREFIX: C
J1_1-32_IN J2_33-64_IN J3_REF_IN J4_1-32_OUT J5_33-64_OUT J6_REF_OUT = FTSH-120-01-F-DV:FTSH-120-01-F-DV: 40 Position, High Reliability Header Strips, 0.050" pitch Source: Datasheet <http://suddendocs.samtec.com/prints/ftsh-1xx-xx-xxx-dv-xxx-xxx-mkt.pdf>; DESCRIPTION: 40 Position, High Reliability Header Strips, 0.050&quot; pitch; HEIGHT: mm; MANUFACTURER_NAME: SAMTEC; MANUFACTURER_PART_NUMBER: FTSH-120-01-F-DV; MOUSER_PART_NUMBER: 200-FTSH12001FDV; MOUSER_PRICE-STOCK: https://www.mouser.co.uk/ProductDetail/Samtec/FTSH-120-01-F-DV?qs=fxGgxIsqC8JsK39KpwHvLg%3D%3D
R1-R128 = rcl:R-EU_: RESISTOR, European symbol; SPICEPREFIX: R